# EAGLE design ASD2201 (EAGLE 6.3)
DATABASE: ./../../../../../Components/TinyCircuits_Part_Database.txt
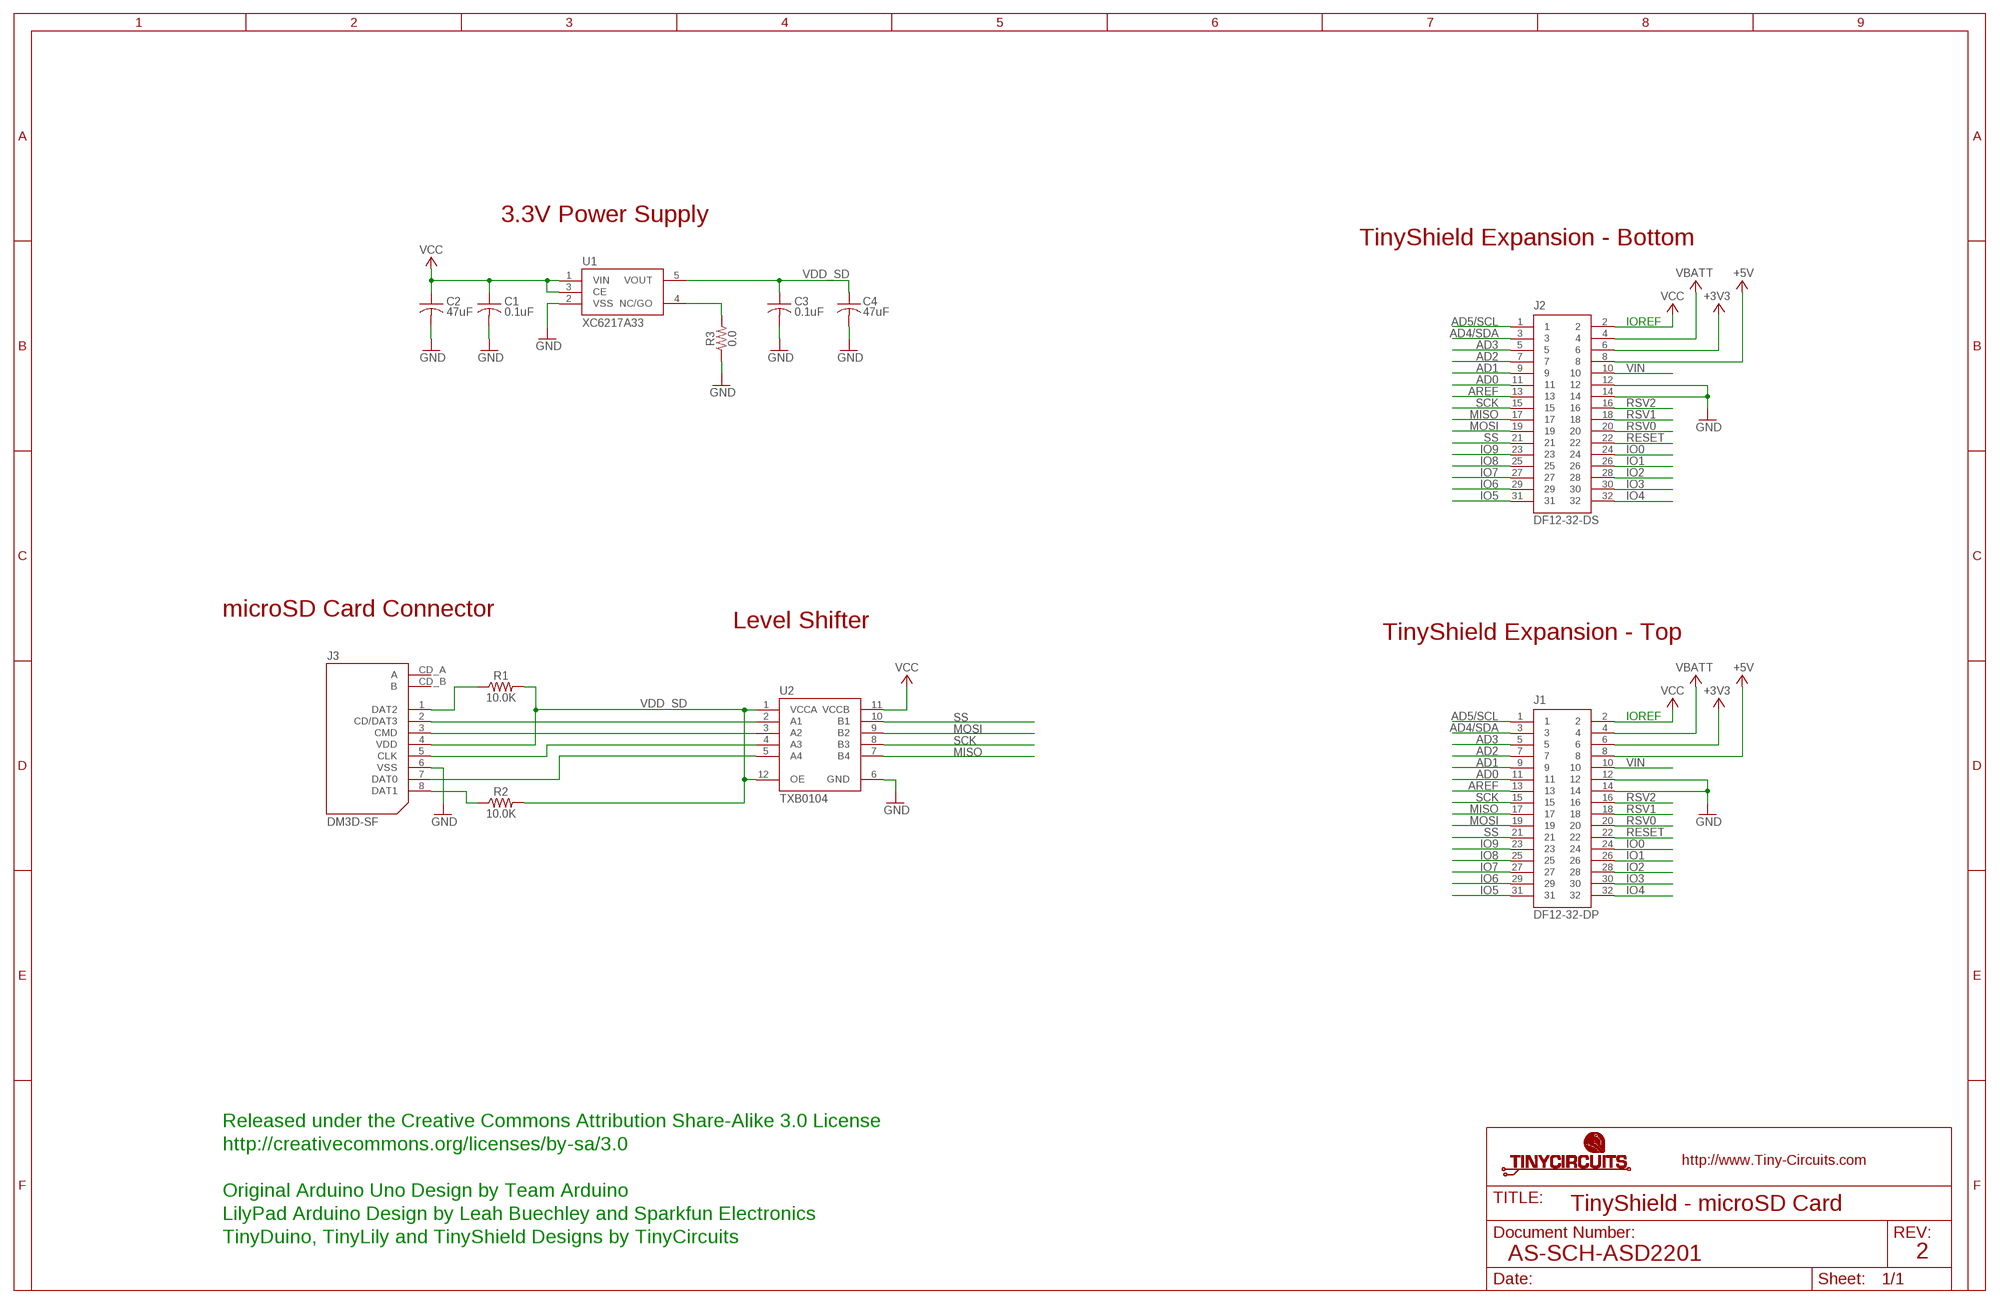
[diagram p0: schematic, sheet 1]

## Parts
C1  0.1uF  AS-ITM-00008  [C0402]
C2  47uF  AS-ITM-00049  [C1206]
C3  0.1uF  AS-ITM-00008  [C0402]
C4  47uF  AS-ITM-00049  [C1206]
J1  DF12-32-DP  AS-ITM-00015  [DF12-32-DP]
J2  DF12-32-DS  AS-ITM-00012  [DF12-32-DS]
J3  DM3D-SF  AS-ITM-00047  [SD_CARD]
R1  10.0K  AS-ITM-00032  [0402]
R2  10.0K  AS-ITM-00032  [0402]
R3  0.0  AS-ITM-00076  [0402]
U1  XC6217A33  AS-ITM-00249  [SOT-25]
U2  TXB0104  AS-ITM-00048  [UQFN-12]

## Nets
+3V3: J1.6 J2.6
+5V: J1.8 J2.8
AD0: J1.11 J2.11
AD1: J1.9 J2.9
AD2: J1.7 J2.7
AD3: J1.5 J2.5
AD4/SDA: J1.3 J2.3
AD5/SCL: J1.1 J2.1
AREF: J1.13 J2.13
GND: C1.2 C2.2 C3.2 C4.2 J1.12 J1.14 J2.12 J2.14 J3.6(VSS) R3.1 U1.2(VSS) U2.6(GND)
IO0: J1.24 J2.24
IO1: J1.26 J2.26
IO2: J1.28 J2.28
IO3: J1.30 J2.30
IO4: J1.32 J2.32
IO5: J1.31 J2.31
IO6: J1.29 J2.29
IO7: J1.27 J2.27
IO8: J1.25 J2.25
IO9: J1.23 J2.23
MISO: J1.17 J2.17 U2.7(B4)
MOSI: J1.19 J2.19 U2.9(B2)
N$1: J3.1(DAT2) R1.1
N$2: J3.8(DAT1) R2.1
N$3: J3.2(CD/DAT3) U2.2(A1)
N$4: J3.3(CMD) U2.3(A2)
N$5: J3.5(CLK) U2.4(A3)
N$6: J3.7(DAT0) U2.5(A4)
N$9: R3.2 U1.4(NC/GO)
RESET: J1.22 J2.22
RSV0: J1.20 J2.20
RSV1: J1.18 J2.18
RSV2: J1.16 J2.16
SCK: J1.15 J2.15 U2.8(B3)
SS: J1.21 J2.21 U2.10(B1)
VBATT: J1.4 J2.4
VCC: C1.1 C2.1 J1.2 J2.2 U1.1(VIN) U1.3(CE) U2.11(VCCB)
VDD_SD: C3.1 C4.1 J3.4(VDD) R1.2 R2.2 U1.5(VOUT) U2.1(VCCA) U2.12(OE)
VIN: J1.10 J2.10
Unconnected: J3.CD_A(A) J3.CD_B(B)

## Notes on the sheet
- 3.3V Power Supply
- TinyShield Expansion - Bottom
- IOREF
- microSD Card Connector
- Level Shifter
- TinyShield Expansion - Top
- IOREF
- Released under the Creative Commons Attribution Share-Alike 3.0 License
- http://creativecommons.org/licenses/by-sa/3.0
- Original Arduino Uno Design by Team Arduino
- TinyShield - microSD Card
- LilyPad Arduino Design by Leah Buechley and Sparkfun Electronics
- TinyDuino, TinyLily and TinyShield Designs by TinyCircuits
- AS-SCH-ASD2201 | 2

## Library data of the parts
C1 C3 = tinycircuits:AS-ITM-00008: CAP CER 0.1UF 16V 10% X5R 0402; PARTNO: AS-ITM-00008
C2 C4 = tinycircuits:AS-ITM-00049: CAP CER 47UF 6.3V 20% X6S 1206; PARTNO: AS-ITM-00049
J1 = tinycircuits:AS-ITM-00015: CONN HEADER 32POS 3MM SMD 0.5MM; PARTNO: AS-ITM-00015
J2 = tinycircuits:AS-ITM-00012: CONN RECEPT 32POS 3MM SMD 0.5MM; PARTNO: AS-ITM-00012
J3 = tinycircuits:AS-ITM-00047: CONN MICRO SD R/A PUSH-PULL SMD; PARTNO: AS-ITM-00047
R1 R2 = tinycircuits:AS-ITM-00032: RES 10.0K OHM 1/16W 1% 0402 SMD; PARTNO: AS-ITM-00032
R3 = tinycircuits:AS-ITM-00076: RES 0.0 OHM 1/16W 1% 0402 SMD; PARTNO: AS-ITM-00076
U1 = tinycircuits:AS-ITM-00249: IC REG LDO 3.3V 0.2A SOT25; PARTNO: AS-ITM-00249
U2 = tinycircuits:AS-ITM-00048: IC VOLT-LEVEL TRANSLATOR 12UQFN; PARTNO: AS-ITM-00048

## Board
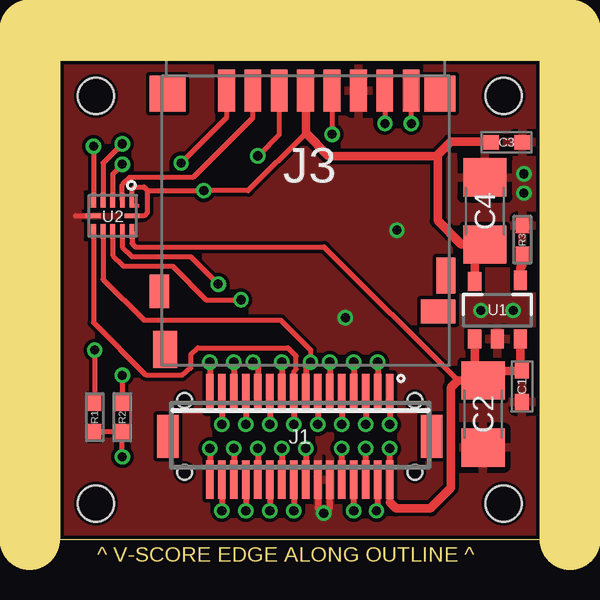
[diagram p1: board, top side]
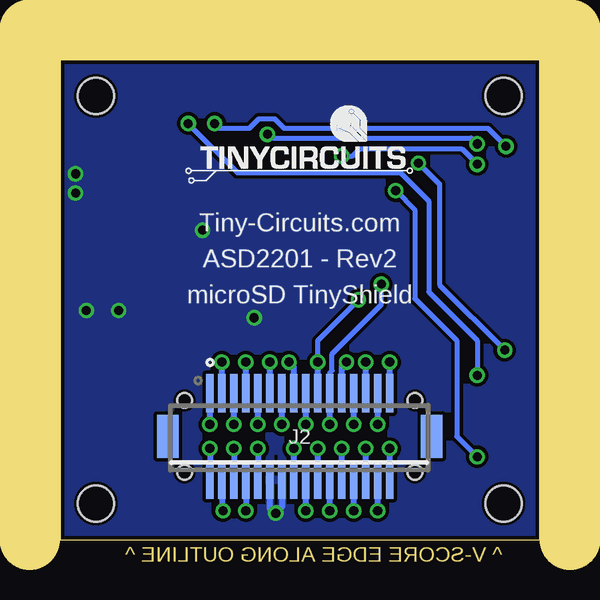
[diagram p2: board, bottom side, seen from below]

Size 20 x 20 mm. Coordinates in mm from the lower left corner, seen from the top.
Outline: 0,20 20,20 20,0 0,0 0,20
Copper layers (1*16): Top 0.035mm / dielectric 1.5mm / Bottom 0.035mm
Design rules "default *": minimum track width 8mil, minimum drill 15mil, track to track 6mil, track to pad 6mil, pad to pad 6mil, via to via 6mil, smd to smd 6mil, copper to edge 6mil, drill to drill 8mil, minimum pad ring 10mil, minimum via ring 5mil, stop-mask expansion 4mil, vias tented up to drill 25mil, thermal gap 10mil
Holes 1.5 mm at 1.5,18.5 18.5,18.5 18.5,1.5 1.5,1.5
Milling: 3 lines

### Footprints (pad centres in the part's own frame; a part is rotated, then mirrored left to right if it is on the bottom)
C0402 = smd 0.65 x 0.6: 1 -0.65,0; 2 0.65,0
C1206 = smd 1.6 x 1.8: 1 -1.4,0; 2 1.4,0
DF12-32-DP = smd 0.3 x 1.6: 1 -3.75,-1.8; 2 -3.75,1.8; 3 -3.25,-1.8; 4 -3.25,1.8; 5 -2.75,-1.8; 6 -2.75,1.8; 7 -2.25,-1.8; 8 -2.25,1.8; 9 -1.75,-1.8; 10 -1.75,1.8; 11 -1.25,-1.8; 12 -1.25,1.8; 13 -0.75,-1.8; 14 -0.75,1.8; 15 -0.25,-1.8; 16 -0.25,1.8; 17 0.25,-1.8; 18 0.25,1.8; 19 0.75,-1.8; 20 0.75,1.8; 21 1.25,-1.8; 22 1.25,1.8; 23 1.75,-1.8; 24 1.75,1.8; 25 2.25,-1.8; 26 2.25,1.8; 27 2.75,-1.8; 28 2.75,1.8; 29 3.25,-1.8; 30 3.25,1.8; 31 3.75,-1.8; 32 3.75,1.8 | smd 0.9 x 1.8: F1 -5.5,0; F2 5.5,0 | hole 0.6: -4.8,1.5; 4.8,1.5
DF12-32-DS = smd 0.3 x 1.6: 1 -3.75,1.8; 2 -3.75,-1.8; 3 -3.25,1.8; 4 -3.25,-1.8; 5 -2.75,1.8; 6 -2.75,-1.8; 7 -2.25,1.8; 8 -2.25,-1.8; 9 -1.75,1.8; 10 -1.75,-1.8; 11 -1.25,1.8; 12 -1.25,-1.8; 13 -0.75,1.8; 14 -0.75,-1.8; 15 -0.25,1.8; 16 -0.25,-1.8; 17 0.25,1.8; 18 0.25,-1.8; 19 0.75,1.8; 20 0.75,-1.8; 21 1.25,1.8; 22 1.25,-1.8; 23 1.75,1.8; 24 1.75,-1.8; 25 2.25,1.8; 26 2.25,-1.8; 27 2.75,1.8; 28 2.75,-1.8; 29 3.25,1.8; 30 3.25,-1.8; 31 3.75,1.8; 32 3.75,-1.8 | smd 0.9 x 1.8: F1 -5.5,0; F2 5.5,0 | hole 0.6: -4.8,1.5; 4.8,1.5
SD_CARD = smd 0.7 x 1.75: 1 3.3,0; 2 2.2,0; 3 1.1,0; 4 0,0; 5 -1.1,0; 6 -2.2,0; 7 -3.3,0; 8 -4.4,0 | smd 1.3 x 1.5: 9 -5.6,0.125 | smd 1.5 x 1.5: 10 5.75,0.125 | smd 0.8 x 1.5: 11 -5.85,7.725 | smd 0.8 x 1.4: 13 6.1,8.375 | smd 1 x 1.55: CD_A 5.85,10.8 | smd 1.45 x 1: CD_B -5.525,9.225
0402 = smd 0.65 x 0.55: 1 -0.6,0; 2 0.6,0
SOT-25 = smd 0.55 x 0.8: 1 -0.95,-1.2; 2 0,-1.2; 3 0.95,-1.2; 4 0.95,1.25; 5 -0.95,1.2
UQFN-12 = smd 0.2 x 0.6: 1 -0.8,-0.65; 2 -0.4,-0.65; 3 0,-0.65; 4 0.4,-0.65; 5 0.8,-0.65; 7 0.8,0.65; 8 0.4,0.65; 9 0,0.65; 10 -0.4,0.65; 11 -0.8,0.65 | smd 0.6 x 0.2: 6 0.8,0; 12 -0.8,0

### Placement (x,y rotation side)
C1  19.26,6.39 270 top
C2  17.64,5.23 270 top
C3  18.62,16.56 0 top
C4  17.72,13.7 90 top
J1  10,4.3 180 top
J2  10,4.3 0 bottom
J3  10.24,18.73 180 top
R1  1.45,5.1 270 top
R2  2.6,5.1 270 top
R3  19.28,12.5 270 top
U1  18.24,9.56 0 top
U2  2.2,13.5 180 top
U$1  [DOCFIELD-TINYCIRCUITS-PCB]  33.91,-10 0 top  (outside the outline)

### Tracks (layer width: path | path; a pad name or v marks a point on that pad's centre or on a via)
+3V3  (via drill 0.38)
  Top 0.254: J2.6 v12.75,3.8
  Bottom 0.254: v12.75,3.8 J2.6
+5V  (via drill 0.38)
  Top 0.254: v12.25,1.2 J2.8
  Bottom 0.254: J2.8 v12.25,1.2
AD0  (via drill 0.38)
  Top 0.254: v11.25,7.4 J2.11
  Bottom 0.254: J2.11 v11.25,7.4
AD1  (via drill 0.38)
  Top 0.254: J2.9 v11.75,4.8
  Bottom 0.254: v11.75,4.8 J2.9
AD2  (via drill 0.38)
  Top 0.254: v12.25,7.4 J2.7
  Bottom 0.254: J2.7 v12.25,7.4
AD3  (via drill 0.38)
  Top 0.254: J2.5 v12.75,4.8
  Bottom 0.254: v12.75,4.8 J2.5
AD4/SDA  (via drill 0.38)
  Top 0.254: v13.25,7.4 J2.3
  Bottom 0.254: J2.3 v13.25,7.4
AD5/SCL  (via drill 0.38)
  Top 0.254: J2.1 v13.75,4.8
  Bottom 0.254: v13.75,4.8 J2.1
AREF  (via drill 0.38)
  Top 0.254: J2.13 v10.75,4.8
  Bottom 0.254: v10.75,4.8 J2.13
GND  (via drill 0.38)
  Top 0.203: U2.6 0.65,13.5
  Top 0.254: v11,1.1 11.05,1.1 11.25,1.3 J2.12 | v11,1.1 10.75,1.35 J2.14 10.75,1.3 11,1.05 v11,1.1
  Bottom 0.254: J2.12 11.25,1.3 11.05,1.1 10.75,1.4 J2.14 10.75,1.35 v11,1.1
  other vias: 11.9,9.25 14.05,12.9 18.9,9.55 17.55,9.55 19.35,15.25 19.35,14.45
  pour Bottom: 0,20 20,20 20,0 0,0
  pour Top: 0,20 20,20 20,0 0,0
IO0  (via drill 0.38)
  Top 0.254: v8.25,3.8 J2.24
  Bottom 0.254: J2.24 v8.25,3.8
IO1  (via drill 0.38)
  Top 0.254: J2.26 v7.75,1.2
  Bottom 0.254: v7.75,1.2 J2.26
IO2  (via drill 0.38)
  Top 0.254: v7.25,3.8 J2.28
  Bottom 0.254: J2.28 v7.25,3.8
IO3  (via drill 0.38)
  Top 0.254: J2.30 v6.75,1.2
  Bottom 0.254: v6.75,1.2 J2.30
IO4  (via drill 0.38)
  Top 0.254: v6.25,3.8 J2.32
  Bottom 0.254: J2.32 v6.25,3.8
IO5  (via drill 0.38)
  Top 0.254: v6.25,7.4 J2.31
  Bottom 0.254: J2.31 v6.25,7.4
IO6  (via drill 0.38)
  Top 0.254: J2.29 v6.75,4.8
  Bottom 0.254: v6.75,4.8 J2.29
IO7  (via drill 0.38)
  Top 0.254: v7.25,7.4 J2.27
  Bottom 0.254: J2.27 v7.25,7.4
IO8  (via drill 0.38)
  Top 0.254: J2.25 v7.75,4.8
  Bottom 0.254: v7.75,4.8 J2.25
IO9  (via drill 0.38)
  Top 0.254: v8.05,7.4 8.25,7.2 J2.23
  Bottom 0.254: J2.23 8.25,7.2 v8.05,7.4
MISO  (via drill 0.38)
  Top 0.203: J2.17 9.75,7 9.85,7.1 9.85,7.65 9.5,8 5.75,8 5.45,7.7 5.45,7.15 5.1,6.85 3.6,6.85 1.4,9.05 U2.7
  Top 0.254: J2.17 v9.75,4.8
  Bottom 0.254: v9.75,4.8 J2.17
MOSI  (via drill 0.38)
  Top 0.203: v7.55,10 6.1,10 4.7,11.4 2.65,11.4 2.2,11.85 U2.9
  Top 0.254: v9.25,7.4 J2.19
  Bottom 0.203: v9.25,7.4 9.25,8.3 v7.55,10
  Bottom 0.254: J2.19 v9.25,7.4
N$1  (via drill 0.38)
  Top 0.203: J3.1 6.94,17.59 v5.05,15.7 | v1.45,7.9 R1.1
  Bottom 0.203: v1.45,7.9 4.18,10.62 4.18,14.82 v5.05,15.7
N$2  (via drill 0.38)
  Top 0.203: J3.8 14.64,17.41 v14.65,17.35 | v2.6,6.85 R2.1
  Bottom 0.203: v14.65,17.35 12.6,15.3 5.8,15.3 4.62,14.12 4.62,10.32 2.6,8.3 v2.6,6.85
N$3
  Top 0.203: U2.2 2.6,14.8 2.9,15.1 5.55,15.1 8.05,17.6 J3.2
N$4  (via drill 0.38)
  Top 0.203: J3.3 9.14,16.89 v8.25,16 | v2.6,15.65 2.2,15.25 U2.3
  Bottom 0.203: v8.25,16 7.8,16 7.5,16.3 3.25,16.3 v2.6,15.65
N$5  (via drill 0.38)
  Top 0.203: v2.6,16.5 1.8,15.7 U2.4 | J3.5 11.34,16.96 v11.35,16.9
  Bottom 0.203: v11.35,16.9 11.2,16.75 2.85,16.75 v2.6,16.5
N$6  (via drill 0.38)
  Top 0.203: J3.7 v13.55,17.35 | v1.4,16.4 U2.5
  Bottom 0.203: v13.55,17.35 13.35,17.15 12.1,17.15 11.7,17.55 11.05,17.55 10.65,17.15 2.15,17.15 v1.4,16.4
N$9
  Top 0.356: R3.2 19.28,11.43 19.2,11.35 19.2,10.82 U1.4
RESET  (via drill 0.38)
  Top 0.254: J2.22 v8.75,1.2
  Bottom 0.254: v8.75,1.2 J2.22
RSV0  (via drill 0.38)
  Top 0.254: v9.25,3.8 J2.20
  Bottom 0.254: J2.20 v9.25,3.8
RSV1  (via drill 0.38)
  Top 0.254: J2.18 v9.75,1.2
  Bottom 0.254: v9.75,1.2 J2.18
RSV2  (via drill 0.38)
  Top 0.254: v10.25,3.8 J2.16
  Bottom 0.254: J2.16 v10.25,3.8
SCK  (via drill 0.38)
  Top 0.203: v10.45,7.4 10.45,7.9 9.2,9.15 3.5,9.15 1.8,10.85 U2.8
  Top 0.254: v10.45,7.4 10.25,7.2 J2.15
  Bottom 0.254: J2.15 10.25,7.2 v10.45,7.4
SS  (via drill 0.38)
  Top 0.203: v6.6,10.65 5.45,11.8 3,11.8 2.6,12.2 U2.10
  Top 0.254: J2.21 v8.75,4.8
  Bottom 0.203: J2.21 8.75,6.95 8.65,7.05 8.65,7.75 6.6,9.8 v6.6,10.65
  Bottom 0.254: v8.75,4.8 J2.21
VBATT  (via drill 0.38)
  Top 0.254: v13.2,1.2 13.25,1.25 J2.4
  Bottom 0.254: J2.4 13.25,1.25 v13.2,1.2
VCC  (via drill 0.38)
  Top 0.203: 16.58,6.63 11.02,12.2 3.15,12.2 3,12.35 U2.11
  Top 0.254: v13.75,3.8 J2.2 13.75,1.55
  Top 0.356: C2.1 16.58,6.63 16.3,6.35 16.3,2.15 15.45,1.3 14,1.3 13.75,1.55 | U1.1 17.29,6.98 C2.1 | C2.1 18.05,7.04 C1.1 19.19,7.11 U1.3
  Bottom 0.254: v13.75,3.8 J2.2
VDD_SD  (via drill 0.38)
  Top 0.203: U2.1 3,14.6 3.1,14.7 3.5,14.7 3.65,14.55 | U2.12 3.5,13.5 3.65,13.65 3.65,14.55 | 10.25,16.95 7.85,14.55 v6,14.55 3.65,14.55 | v2.6,3.45 R2.2 R1.2
  Top 0.356: U1.5 17.29,11.88 C4.1 16.75,12.3 15.75,13.3 15.75,15.95 15.7,16 | C3.1 17.94,16.6 16.3,16.6 15.7,16 | J3.4 10.25,16.95 11.2,16 15.7,16
  Bottom 0.203: v6,14.55 5.2,13.75 5.2,10.05 3.45,8.3 3.45,4.3 v2.6,3.45
VIN  (via drill 0.38)
  Top 0.254: J2.10 v11.75,3.8
  Bottom 0.254: v11.75,3.8 J2.10

### Text on the board
Dimension: ^ V-SCORE EDGE ALONG OUTLINE ^
bPlace: Tiny-Circuits.com | ASD2201 - Rev2 | microSD TinyShield
Document: FABRICATION DRAWING | NOTES: | 1. PRINTED CIRCUIT BOARD MADE FROM NEMA GRADE FR-4 EPOXY LAMINATE | WITH 1 OUNCE COPPER PLATING AND .024 THICKNESS. | 2. ALL DIMENSIONS ARE GIVEN IN INCHES. | 3. CIRCUIT PATHS ARE FOR REFERENCE ONLY. | 4. HOLE SIZES SHOWN ARE FINISHED DIAMETERS AFTER PLATING. | 5. BOARD PLATED USING REFLOW OR SIMILAR METHOD. | 6. BOARD TO HAVE BLUE SOLDER MASK ON PLATED SURFACES USING WET FILM | 7. SILKSCREEN BOARD USING WHITE INK. | SR100 OR SR1010 EPOXY. EQUIVALENT WET OR DRY FILM MAY BE USED. | 8. THE FOLLOWING INFORMATION APPLIES TO THIS BOARD: | * 2 COPPER LAYERS | * .024 BOARD THICKNESS | * REQUIRES TOP SIDE SILKSCREEN | Released under the Creative Commons Attribution Share-Alike 3.0 License | http://creativecommons.org/licenses/by-sa/3.0 | Original Arduino Uno Design by Team Arduino | LilyPad Arduino Design by Leah Buechley and Sparkfun Electronics | TinyDuino, TinyLily and TinyShield Designs by TinyCircuits | TinyShield - microSD Card | AS-PCB-ASD2201 | 2